# Altium schematic sheet fpga_pwr.SchDoc
size A4
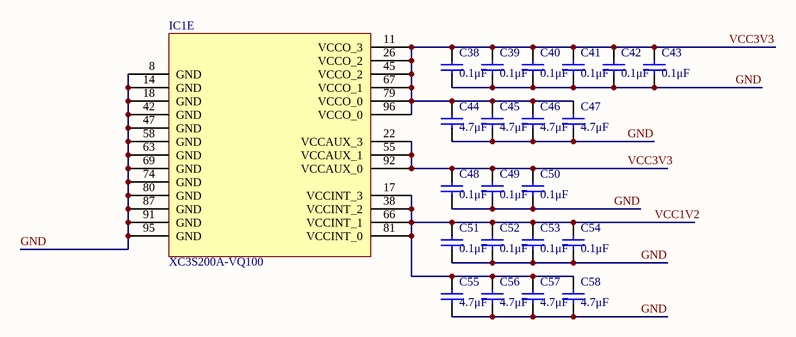
[diagram p0: fpga_pwr.SchDoc]

## Parts
C38  value 0.1μF  [1608[0603]]  (hidden comment: Cap Semi)
C39  value 0.1μF  [1608[0603]]  (hidden comment: Cap Semi)
C40  value 0.1μF  [1608[0603]]  (hidden comment: Cap Semi)
C41  value 0.1μF  [1608[0603]]  (hidden comment: Cap Semi)
C42  value 0.1μF  [1608[0603]]  (hidden comment: Cap Semi)
C43  value 0.1μF  [1608[0603]]  (hidden comment: Cap Semi)
C44  value 4.7μF  [1608[0603]]  (hidden comment: Cap Semi)
C45  value 4.7μF  [1608[0603]]  (hidden comment: Cap Semi)
C46  value 4.7μF  [1608[0603]]  (hidden comment: Cap Semi)
C47  value 4.7μF  [1608[0603]]  (hidden comment: Cap Semi)
C48  value 0.1μF  [1608[0603]]  (hidden comment: Cap Semi)
C49  value 0.1μF  [1608[0603]]  (hidden comment: Cap Semi)
C50  value 0.1μF  [1608[0603]]  (hidden comment: Cap Semi)
C51  value 0.1μF  [1608[0603]]  (hidden comment: Cap Semi)
C52  value 0.1μF  [1608[0603]]  (hidden comment: Cap Semi)
C53  value 0.1μF  [1608[0603]]  (hidden comment: Cap Semi)
C54  value 0.1μF  [1608[0603]]  (hidden comment: Cap Semi)
C55  value 4.7μF  [1608[0603]]  (hidden comment: Cap Semi)
C56  value 4.7μF  [1608[0603]]  (hidden comment: Cap Semi)
C57  value 4.7μF  [1608[0603]]  (hidden comment: Cap Semi)
C58  value 4.7μF  [1608[0603]]  (hidden comment: Cap Semi)
IC1  XC3S200A-VQ100  [QFP50P1600X1600X120-100N]  (part E of 6)

## Nets
GND: C38.1 C39.1 C40.1 C41.1 C42.1 C43.1 C44.1 C45.1 C46.1 C47.1 C48.1 C49.1 C50.1 C51.1 C52.1 C53.1 C54.1 C55.1 C56.1 C57.1 C58.1 IC1.8(GND) IC1.14(GND) IC1.18(GND) IC1.42(GND) IC1.47(GND) IC1.58(GND) IC1.63(GND) IC1.69(GND) IC1.74(GND) IC1.80(GND) IC1.87(GND) IC1.91(GND) IC1.95(GND)
VCC1V2: C51.2 C52.2 C53.2 C54.2 C55.2 C56.2 C57.2 C58.2 IC1.17(VCCINT_3) IC1.38(VCCINT_2) IC1.66(VCCINT_1) IC1.81(VCCINT_0)
VCC3V3: C38.2 C39.2 C40.2 C41.2 C42.2 C43.2 C44.2 C45.2 C46.2 C47.2 C48.2 C49.2 C50.2 IC1.11(VCCO_3) IC1.22(VCCAUX_3) IC1.26(VCCO_2) IC1.45(VCCO_2) IC1.55(VCCAUX_1) IC1.67(VCCO_1) IC1.79(VCCO_0) IC1.92(VCCAUX_0) IC1.96(VCCO_0)

## Library data of the parts
C38-C58 = Cap Semi: Capacitor (Semiconductor SIM Model); Published: 8-Jun-2000; LatestRevisionDate: 29-May-2009; LatestRevisionNote: IPC-7351 Footprint Added.; PackageReference: C1206; Publisher: Altium Limited; PackageDescription: Chip Capacitor